# Altium schematic sheet MCU.SchDoc
size A4; SheetNumber: 3; SheetTotal: 5
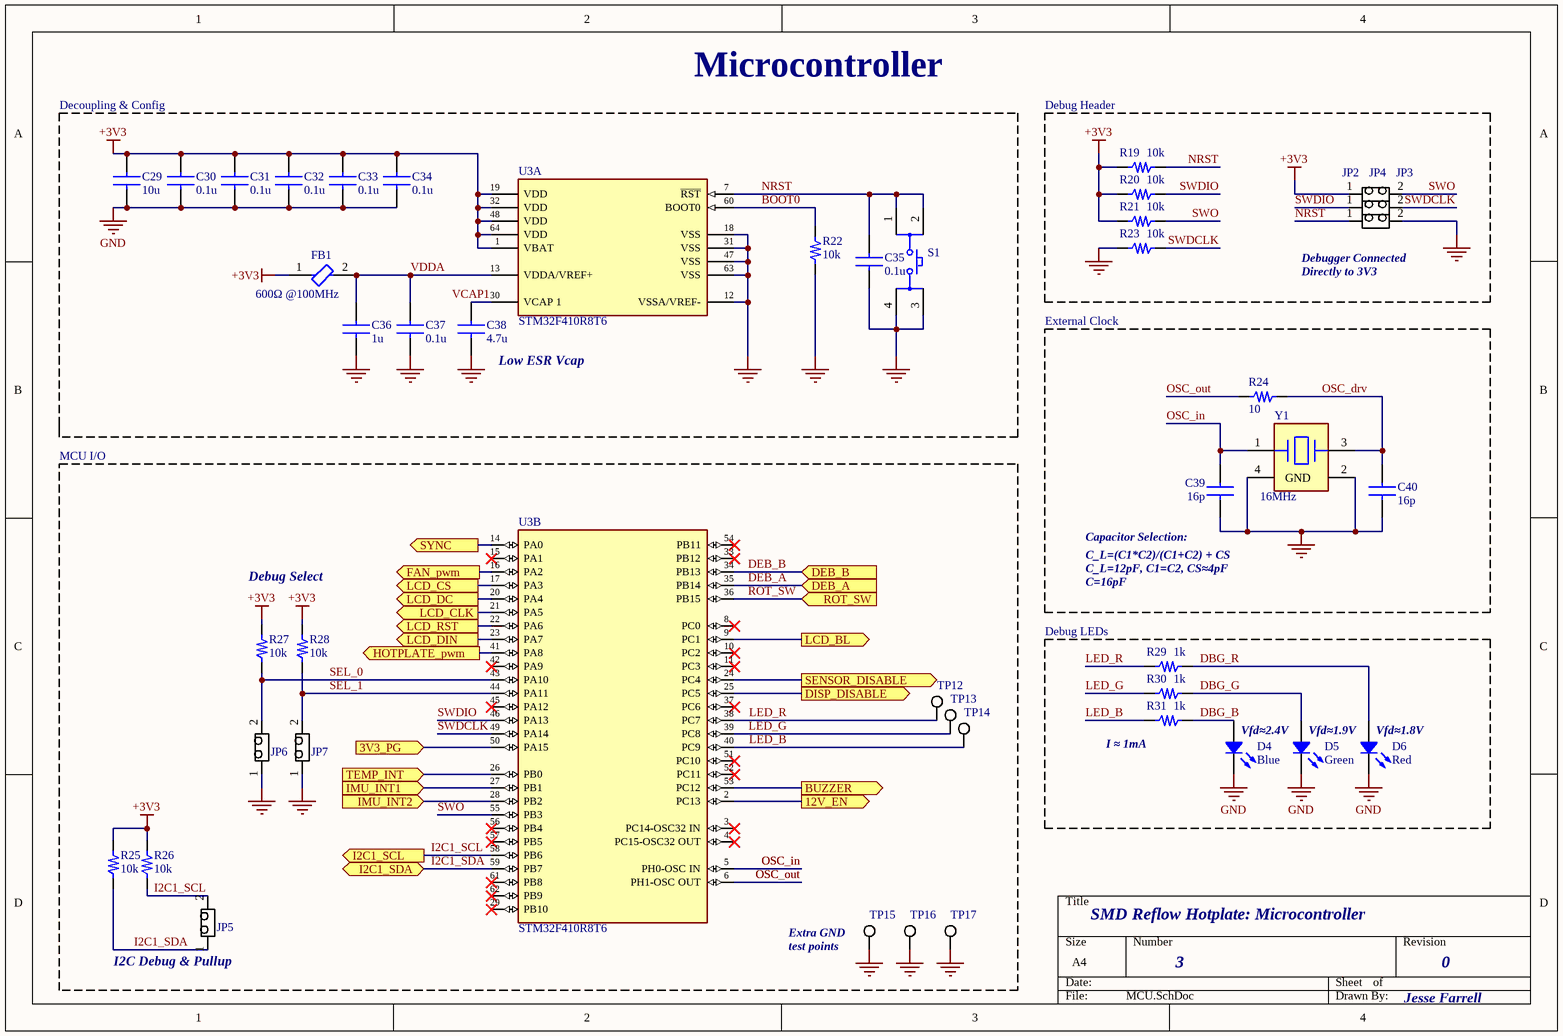
[diagram p0: MCU.SchDoc]

## Parts
C29  10u  [FP-CL10-IPC_C]
C30  0.1u  [FP-CL10-IPC_C]
C31  0.1u  [FP-CL10-IPC_C]
C32  0.1u  [FP-CL10-IPC_C]
C33  0.1u  [FP-CL10-IPC_C]
C34  0.1u  [FP-CL10-IPC_C]
C35  0.1u  [FP-CL10-IPC_C]
C36  1u  [FP-CL10-IPC_C]
C37  0.1u  [FP-CL10-IPC_C]
C38  4.7u  [FP-CL10-IPC_C]
C39  16p  [FP-CL10-IPC_C]
C40  16p  [FP-CL10-IPC_C]
D4  Blue  [LED 0603_1608 BLUE]
D5  Green  [LED 0603_1608 GREEN]
D6  Red  [LED 0603_1608 RED]
FB1  600Ω @100MHz  [FP-BLM18-0_15-t0_8-MFG]
JP2  HDR_1x2  [FP-TSW-102-07-L-S-MFG]  (value not drawn)
JP3  HDR_1x2  [FP-TSW-102-07-L-S-MFG]  (value not drawn)
JP4  HDR_1x2  [FP-TSW-102-07-L-S-MFG]  (value not drawn)
JP5  HDR_1x2  [FP-TSW-102-07-L-S-MFG]  (value not drawn)
JP6  HDR_1x2  [FP-TSW-102-07-L-S-MFG]  (value not drawn)
JP7  HDR_1x2  [FP-TSW-102-07-L-S-MFG]  (value not drawn)
R19  10k  [FP-RMCF0603-MFG]
R20  10k  [FP-RMCF0603-MFG]
R21  10k  [FP-RMCF0603-MFG]
R22  10k  [FP-RMCF0603-MFG]
R23  10k  [FP-RMCF0603-MFG]
R24  10  [FP-RMCF0603-MFG]
R25  10k  [FP-RMCF0603-MFG]
R26  10k  [FP-RMCF0603-MFG]
R27  10k  [FP-RMCF0603-MFG]
R28  10k  [FP-RMCF0603-MFG]
R29  1k  [FP-RMCF0603-MFG]
R30  1k  [FP-RMCF0603-MFG]
R31  1k  [FP-RMCF0603-MFG]
S1  PushButton  [FP-TL3301AF160QG-MFG]  (value not drawn)
TP12  TEST POINT  [KSTN-5003]  (value not drawn)
TP13  TEST POINT  [KSTN-5003]  (value not drawn)
TP14  TEST POINT  [KSTN-5003]  (value not drawn)
TP15  BLCK TEST POINT  [FP-5001-MFG]  (value not drawn)
TP16  BLCK TEST POINT  [FP-5001-MFG]  (value not drawn)
TP17  BLCK TEST POINT  [FP-5001-MFG]  (value not drawn)
U3  STM32F410R8T6  [FP-LQFP64-5W-IPC_B]  (parts A,B of 2)
Y1  16MHz  [FP-8Y-MFG]

## Blocks framed on the sheet
Debug Header: JP2-JP4 R19-R21 R23
Debug LEDs: D4-D6 R29-R31

## Ports
3V3_PG (in), 12V_EN (out), BUZZER (out), DEB_A (in), DEB_B (in), DISP_DISABLE (out), FAN_pwm (out), HOTPLATE_pwm (out), I2C1_SCL (out), I2C1_SDA (bidir), IMU_INT1 (in), IMU_INT2 (in), LCD_BL (out), LCD_CLK (out), LCD_CS (out), LCD_DC (out), LCD_DIN (out), LCD_RST (out), ROT_SW (in), SENSOR_DISABLE (out), SYNC (out), TEMP_INT (in)

## Nets
+3V3: C29.1 C30.1 C31.1 C32.1 C33.1 C34.1 FB1.1 JP2.1 R19.2 R20.2 R21.2 R25.2 R26.2 R27.2 R28.2 U3.1(VBAT) U3.19(VDD) U3.32(VDD) U3.48(VDD) U3.64(VDD)
GND: C29.2 C30.2 C31.2 C32.2 C33.2 C34.2 C35.2 C36.2 C37.2 C38.2 C39.2 C40.2 D4.2 D5.2 D6.2 JP4.2 JP6.1 JP7.1 R22.1 R23.2 S1.3 S1.4 TP15.1 TP16.1 TP17.1 U3.12(VSSA/VREF-) U3.18(VSS) U3.31(VSS) U3.47(VSS) U3.63(VSS) Y1.2(GND) Y1.4(GND)
3V3_PG: U3.50(PA15) ; port 3V3_PG
12V_EN: U3.2(PC13) ; port 12V_EN
BOOT0: R22.2 U3.60(BOOT0)
BUZZER: U3.53(PC12) ; port BUZZER
DBG_B: D4.1 R31.1
DBG_G: D5.1 R30.1
DBG_R: D6.1 R29.1
DEB_A: U3.35(PB14) ; port DEB_A
DEB_B: U3.34(PB13) ; port DEB_B
DISP_DISABLE: U3.25(PC5) ; port DISP_DISABLE
FAN_pwm: U3.16(PA2) ; port FAN_pwm
HOTPLATE_pwm: U3.41(PA8) ; port HOTPLATE_pwm
I2C1_SCL: JP5.2 R26.1 U3.58(PB6) ; port I2C1_SCL
I2C1_SDA: JP5.1 R25.1 U3.59(PB7) ; port I2C1_SDA
IMU_INT1: U3.27(PB1) ; port IMU_INT1
IMU_INT2: U3.28(PB2) ; port IMU_INT2
LCD_BL: U3.9(PC1) ; port LCD_BL
LCD_CLK: U3.21(PA5) ; port LCD_CLK
LCD_CS: U3.17(PA3) ; port LCD_CS
LCD_DC: U3.20(PA4) ; port LCD_DC
LCD_DIN: U3.23(PA7) ; port LCD_DIN
LCD_RST: U3.22(PA6) ; port LCD_RST
LED_B: R31.2 TP14.1 U3.40(PC9)
LED_G: R30.2 TP13.1 U3.39(PC8)
LED_R: R29.2 TP12.1 U3.38(PC7)
NRST: C35.1 JP4.1 R19.1 S1.1 S1.2 U3.7(~{RST})
OSC_drv: C40.1 R24.1 Y1.3
OSC_in: C39.1 U3.5(PH0-OSC_IN) Y1.1
OSC_out: R24.2 U3.6(PH1-OSC_OUT)
ROT_SW: U3.36(PB15) ; port ROT_SW
SEL_0: JP6.2 R27.1 U3.43(PA10)
SEL_1: JP7.2 R28.1 U3.44(PA11)
SENSOR_DISABLE: U3.24(PC4) ; port SENSOR_DISABLE
SWDCLK: JP3.2 R23.1 U3.49(PA14)
SWDIO: JP3.1 R20.1 U3.46(PA13)
SWO: JP2.2 R21.1 U3.55(PB3)
SYNC: U3.14(PA0) ; port SYNC
TEMP_INT: U3.26(PB0) ; port TEMP_INT
VCAP1: C38.1 U3.30(VCAP_1)
VDDA: C36.1 C37.1 FB1.2 U3.13(VDDA/VREF+)

Not connected (* = marked no-connect by the designer): U3 3(PC14-OSC32_IN)* 4(PC15-OSC32_OUT)* 8(PC0)* 10(PC2)* 11(PC3)* 15(PA1)* 29(PB10)* 33(PB12)* 37(PC6)* 42(PA9)* 45(PA12)* 51(PC10)* 52(PC11)* 54(PB11)* 56(PB4)* 57(PB5)* 61(PB8)* 62(PB9)*

## Notes on the sheet
- Decoupling & Config
- Microcontroller
- Debugger Connected
  Directly to 3V3
- Low ESR Vcap
- External Clock
- MCU I/O
- Debug Select
- (near C39) Capacitor Selection: <https://www.st.com/resource/en/application_note/cd00221665-oscillator-design-guide-for-stm8afals-stm32-mcus-and-mpus-stmicroelectronics.pdf>
- C_L=(C1*C2)/(C1+C2) + CS
  C_L=12pF, C1=C2, CS≈4pF
  C=16pF
- (near R31) I ≈ 1mA
- (near D5) Vfd≈2.4V
- (near D6) Vfd≈1.9V
- (near D6) Vfd≈1.8V
- (near JP5) I2C Debug & Pullup
- (near TP15) Extra GND
  test points
- SMD Reflow Hotplate: Microcontroller
- 3
- 0
- Jesse Farrell

## Library data of the parts
C29 = CapTemplate0603: Cap Ceramic 10uF 16V X5R 10% SMD 0603; Capacitance: 0.1uF; Supplier 1: Digi-Key; RoHS: Yes; Category: Ceramic Capacitors; Mount: Surface Mount; Case/Package: 0603; Case Code (Metric): 1608; Case Code (Imperial): 0603; Packaging: Tape and Reel; Voltage Rating: 16V; Tolerance: 10%; Length: 0.063inch; Width: 0.031inch; Thickness: 0.035inch; ComponentLink1Description: DigikeyPart; ComponentLink1URL: https://www.digikey.ca/en/products/detail/samsung-electro-mechanics/CL10B104KO8NNNC/3886663
C30-C35 C37 = CapTemplate0603: Cap Ceramic 0.1uF 16V X7R 10% SMD 0603; Supplier 1: Digi-Key; RoHS: Yes; Category: Ceramic Capacitors; Mount: Surface Mount; Case/Package: 0603; Case Code (Metric): 1608; Case Code (Imperial): 0603; Packaging: Tape and Reel; Capacitance: 0.1uF; Voltage Rating: 16V; Tolerance: 10%; Length: 0.063inch; Width: 0.031inch; Thickness: 0.035inch; ComponentLink1Description: DigikeyPart; ComponentLink1URL: https://www.digikey.ca/en/products/detail/samsung-electro-mechanics/CL10B104KO8NNNC/3886663
C36 = CapTemplate0603: Cap Ceramic 1uF 16V X5R 10% SMD 0603; Supplier 1: Digi-Key; RoHS: Yes; Category: Ceramic Capacitors; Mount: Surface Mount; Case/Package: 0603; Case Code (Metric): 1608; Case Code (Imperial): 0603; Packaging: Tape and Reel; Capacitance: 1uF; Voltage Rating: 16V; Tolerance: 10%; Length: 0.063inch; Width: 0.031inch; Thickness: 0.035inch; ComponentLink1Description: DigikeyPart; ComponentLink1URL: https://www.digikey.ca/en/products/detail/samsung-electro-mechanics/CL10B104KO8NNNC/3886663
C38 = CapTemplate0603: Cap Ceramic 4.7uF 16V X5R 10% SMD 0603; Supplier 1: Digi-Key; RoHS: Yes; Category: Ceramic Capacitors; Mount: Surface Mount; Case/Package: 0603; Case Code (Metric): 1608; Case Code (Imperial): 0603; Packaging: Tape and Reel; Capacitance: 4.7uF; Voltage Rating: 16V; Tolerance: 10%; Length: 0.063inch; Width: 0.031inch; Thickness: 0.035inch
C39 C40 = CapTemplate0603: Cap Ceramic 16p 10V X7R 10% SMD 0603; Capacitance: ??uF; Voltage Rating: ??V; Tolerance: ??%; Supplier 1: Digi-Key; RoHS: Yes; Category: Ceramic Capacitors; Mount: Surface Mount; Case/Package: 0603; Case Code (Metric): 1608; Case Code (Imperial): 0603; Packaging: Tape and Reel; Length: 0.063inch; Width: 0.031inch; Thickness: 0.035inch
D4 = AA1608QBS/D-10MAV: 1.6X0.8MM BLUE SMD LED; Manufacturer: Kingbright; Current - Test: 10mA; Lens Color: Colorless; Lens Size: 1.40mm x 0.80mm; Lens Style: Rectangle with Flat Top; Lens Transparency: Clear; Millicandela Rating: 80mcd; Viewing Angle: 120°; Voltage - Forward (Vf) (Typ): 3V; Wavelength - Dominant: 465nm; Wavelength - Peak: 460nm; Part Number: AA1608QBS/D-10MAV; Color: Blue; ComponentLink1Description: Datasheet; ComponentLink1URL: https://www.kingbrightusa.com/images/catalog/SPEC/AA1608QBS-D-10MAV.pdf; ComponentLink2Description: DigiKey Link; ComponentLink2URL: https://www.digikey.com/en/products/detail/kingbright/AA1608QBS-D-10MAV/13997416; Device Package: 0603 (1608 Metric); Height (Max): 0.65mm; LastUpdated: 2022-06-14 9:41:25 PM; Lifecycle Status: Active; Minimum Order: 1; Mounting Type: Surface Mount; Package / Case: 0603 (1608 Metric); Packaging: TapeAndReel; PartId: 972; Part Status: Active; Price: 0.12; Series: -; Size / Dimension: 1.60mm L x 0.80mm W; Supplier 1: DigiKey; Supplier Part Number 1: 754-AA1608QBS/D-10MAVCT-ND; Supplier Device Package: 0603; Value: Blue
D5 = AA1608CGSK: 1.6X0.8MM GREEN SMD LED; Manufacturer: Kingbright; Current - Test: 20mA; Lens Color: Colorless; Lens Style: Rectangle with Flat Top; Lens Transparency: Clear; Millicandela Rating: 75mcd; Viewing Angle: 120°; Voltage - Forward (Vf) (Typ): 2.1V; Wavelength - Dominant: 570nm; Wavelength - Peak: 574nm; Part Number: AA1608CGSK; Color: Green; ComponentLink1Description: Datasheet; ComponentLink1URL: https://www.kingbrightusa.com/images/catalog/SPEC/AA1608CGSK.pdf; ComponentLink2Description: DigiKey Link; ComponentLink2URL: https://www.digikey.com/en/products/detail/kingbright/AA1608CGSK/13679426; Device Package: 0603 (1608 Metric); Height (Max): 0.70mm; LastUpdated: 2022-06-12 5:46:55 PM; Lifecycle Status: Active; Minimum Order: 1; Mounting Type: Surface Mount; Package / Case: 0603 (1608 Metric); Packaging: TapeAndReel; PartId: 995; Part Status: Active; Price: 0.12; Series: -; Size / Dimension: 1.60mm L x 0.80mm W; Supplier 1: DigiKey; Supplier Part Number 1: 754-AA1608CGSKCT-ND; Supplier Device Package: 0603; Value: Green
D6 = AA1608SURSK: 1.6X0.8MM RED SMD LED; Manufacturer: Kingbright; Current - Test: 20mA; Lens Color: Colorless; Lens Style: Rectangle with Flat Top; Lens Transparency: Clear; Millicandela Rating: 480mcd; Viewing Angle: 120°; Voltage - Forward (Vf) (Typ): 1.95V; Wavelength - Dominant: 630nm; Wavelength - Peak: 645nm; Part Number: AA1608SURSK; Color: Red; ComponentLink1Description: Datasheet; ComponentLink1URL: https://www.kingbrightusa.com/images/catalog/SPEC/AA1608SURSK.pdf; ComponentLink2Description: DigiKey Link; ComponentLink2URL: https://www.digikey.com/en/products/detail/kingbright/AA1608SURSK/13679445; Device Package: 0603 (1608 Metric); Height (Max): 0.70mm; LastUpdated: 2022-06-14 9:41:53 PM; Lifecycle Status: Active; Minimum Order: 1; Mounting Type: Surface Mount; Package / Case: 0603 (1608 Metric); Packaging: TapeAndReel; PartId: 1013; Part Status: Active; Price: 0.12; Series: -; Size / Dimension: 1.60mm L x 0.80mm W; Supplier 1: DigiKey; Supplier Part Number 1: 754-AA1608SURSKCT-ND; Supplier Device Package: 0603; Value: Red
FB1 = 782633601: Ferrite Bead, Aec-Q200, 600 Ohm, 0603 Rohs Compliant: Yes; Manufacturer: Wurth Electronics; Number of Lines: 1; Max Current Rating: 1A; DC Resistance (DCR): 200mR; Supplier 1: Digi-Key; Manufacturer Part Number: 782633601; RoHS: Yes; Category: Ferrite Beads and Chips; Stock 1: 21300; Mount: Surface Mount; Case/Package: 0603; Case Code (Metric): 1608; Case Code (Imperial): 0603; Min Operating Temperature: -55°C; Max Operating Temperature: 125°C; Package Quantity: 4000; Packaging: Tape and Reel; Length: 0.063inch; Width: 0.031inch; Height: 0.039inch; Ratings: AEC-Q200; RoHS Compliant: No; ComponentLink1URL: https://media.digikey.com/pdf/Data%20Sheets/Wurth%20Electronics%20PDFs/Q+_Products_Flyer.pdf?src-supplier=Digi-Key; ComponentLink1Description: https://media.digikey.com/pdf/Data%20Sheets/Wurth%20Electronics%20PDFs/Q+_Products_Flyer.pdf?src-supplier=Digi-Key; ComponentLink2URL: http://katalog.we-online.de/pbs/datasheet/782633601.pdf?src-supplier=Digi-Key; ComponentLink2Description: http://katalog.we-online.de/pbs/datasheet/782633601.pdf?src-supplier=Digi-Key; Supplier Part Number 1: 732-6703-1-ND
JP2-JP7 = PH1-02-UA: Conn Unshrouded Header HDR 2 POS 2.54mm Solder ST Thru-Hole Bag; Manufacturer: Adam Equipment; Current Rating: 3A; Voltage Rating: 250V; Number of Positions: 2; Supplier 1: Digi-Key; Manufacturer Part Number: PH1-02-UA; RoHS: Yes; Category: Connectors; Stock 1: 124311; Contact Material: Brass; Contact Plating: Gold; Housing Material: PBT; Contact Gender: Male; Number of Rows: 1; Termination: Solder; Pitch: 2.54mm; Lead Free: Lead Free; ComponentLink1URL: https://datasheet.ciiva.com/16392/ph1-xx-ua-16392701.pdf?src-supplier=Future+Electronics; ComponentLink1Description: https://datasheet.ciiva.com/16392/ph1-xx-ua-16392701.pdf?src-supplier=Future+Electronics; ComponentLink2URL: https://datasheet.ciiva.com/5160/page-292-295-12946-5160830.pdf?src-supplier=Mouser; ComponentLink2Description: https://datasheet.ciiva.com/5160/page-292-295-12946-5160830.pdf?src-supplier=Mouser; Supplier Part Number 1: 2057-PH1-02-UA-ND
R19-R23 R25-R28 = ResTemplate0603: Res 0603 10K Ohm 1% 1/10W; Tolerance: ???%; Power Rating: ???mW; Resistance: ???; Supplier 1: Digi-Key; Category: Chip SMD Resistors; Mount: Surface Mount; Case/Package: 0603; Case Code (Metric): 1608; Case Code (Imperial): 0603; Number of Terminations: 2; Length: 0.061inch; Width: 0.031inch; Height: 0.022inch
R24 = ResTemplate0603: Res 0603 10 Ohm 1% 1/10W; Tolerance: ???%; Power Rating: ???mW; Resistance: ???; Supplier 1: Digi-Key; Category: Chip SMD Resistors; Mount: Surface Mount; Case/Package: 0603; Case Code (Metric): 1608; Case Code (Imperial): 0603; Number of Terminations: 2; Length: 0.061inch; Width: 0.031inch; Height: 0.022inch
R29-R31 = ResTemplate0603: Res 0603 1K Ohm 1% 1/8W; Tolerance: ???%; Power Rating: ???mW; Resistance: ???; Supplier 1: Digi-Key; Category: Chip SMD Resistors; Mount: Surface Mount; Case/Package: 0603; Case Code (Metric): 1608; Case Code (Imperial): 0603; Number of Terminations: 2; Length: 0.061inch; Width: 0.031inch; Height: 0.022inch
S1 = PTS645SL43SMTR92LFS: Switch Tactile N.O. SPST Round Button Gull Wing 0.05A 12VDC 100000Cycles 1.27N SMD T/R; Manufacturer: ITT C&K; Actuator Material: Nylon,Polyamide,PA66; Max Voltage Rating (DC): 12V; Contact Resistance: 100mR; Max Current Rating: 50mA; Illumination Type: Non-Illuminated; Switch Function: Off-Mom; Actuator Type: Standard; Actuator Length: 0.85mm; Supplier 1: Digi-Key; Manufacturer Part Number: PTS645SL43SMTR92LFS; RoHS: Yes; Category: Tactile Switches; Stock 1: 20686; Mount: Surface Mount; Contact Material: Bronze,Brass,Silver; Contact Plating: Silver; Mechanical Life: 100000Cycles; Color: Black; Min Operating Temperature: -20°C; Max Operating Temperature: 60°C; Throw Configuration: SPST; Operating Force: 1.27N; Packaging: Tape and Reel; Termination: Gull Wing; Voltage Rating (DC): 12V; Package Quantity: 1000; Current Rating: 50mA; Orientation: Straight; Series: PTS645; Length: 6mm; Depth: 9mm; Size: 6mm; Lead Free: Lead Free; RoHS Compliant: Yes; ComponentLink1URL: https://datasheet.ciiva.com/26927/getdatasheetpartid-774114-26927132.pdf?src-supplier=Verical; ComponentLink1Description: https://datasheet.ciiva.com/26927/getdatasheetpartid-774114-26927132.pdf?src-supplier=Verical; Supplier Part Number 1: CKN10880CT-ND
TP12-TP14 = 5003: Test Point;  Miniature;  THM;  H .300;  Nylon 46 Insulated Orange;  PhosBronze/Silver; Manufacturer: Keystone Electronics; Body Material: PBT; Plating: Silver; Inside Diameter: 1.27mm; Outside Diameter: 2.54mm; Supplier 1: Digi-Key; Manufacturer Part Number: 5003; RoHS: Yes; Category: Connectors; Stock 1: 166018; Mount: PCB,Through Hole; Number of Pins: 1; Contact Material: Bronze; Contact Plating: Silver,Tin; Material: Nylon,Bronze,Silver; Color: Orange,White; Package Quantity: 10; Packaging: Bulk; Series: THM; Termination: Through Hole; Length: 7.62mm; Height: 0.3inch; REACH SVHC: No SVHC; Lead Free: Lead Free; RoHS Compliant: Yes; Flammability Rating: UL94 V-0; ComponentLink1URL: https://datasheet.ciiva.com/16885/70182825-16885788.pdf?src-supplier=Allied+Electronics; ComponentLink1Description: https://datasheet.ciiva.com/16885/70182825-16885788.pdf?src-supplier=Allied+Electronics; ComponentLink2URL: https://datasheet.ciiva.com/1454/1703983-1454826.pdf?src-supplier=Element14; ComponentLink2Description: https://datasheet.ciiva.com/1454/1703983-1454826.pdf?src-supplier=Element14; ComponentLink3URL: https://datasheet.ciiva.com/22631/1703983-22631103.pdf?src-supplier=Element14; ComponentLink3Description: https://datasheet.ciiva.com/22631/1703983-22631103.pdf?src-supplier=Element14; ComponentLink4URL: https://datasheet.ciiva.com/4598/5000-5004-4598618.pdf?src-supplier=Mouser; ComponentLink4Description: https://datasheet.ciiva.com/4598/5000-5004-4598618.pdf?src-supplier=Mouser; Supplier Part Number 1: 36-5003-ND
TP15-TP17 = 5001: TEST POINT PC MINI .040D BLACK; Manufacturer: Keystone Electronics; Body Material: Bronze; Plating: Silver; Number of Ports: 1; Insulation: Insulated; Inside Diameter: 1.27mm; Outside Diameter: 2.54mm; Hole Diameter: 1.6mm; Supplier 1: Digi-Key; Manufacturer Part Number: 5001; RoHS: Yes; Category: Test Probes, Leads and Clips; Stock 1: 1368499; Mount: Through Hole; Contact Material: Bronze; Contact Plating: Silver,Tin; Material: Nylon,Bronze,Silver; Color: Black; Insulation Material: Nylon; Housing Color: Black; Package Quantity: 100; Packaging: Bulk; Series: THM; Termination: Through Hole; Orientation: Straight; Number of Contacts: 1; Diameter: 2.54mm; Length: 7.62mm; Height: 0.3inch; REACH SVHC: No SVHC; Lead Free: Lead Free; RoHS Compliant: Yes; Flammability Rating: UL94 V-0; ComponentLink1URL: https://datasheet.ciiva.com/11836/0900766b8009b7c7-11836045.pdf?src-supplier=RSComponents; ComponentLink1Description: https://datasheet.ciiva.com/11836/0900766b8009b7c7-11836045.pdf?src-supplier=RSComponents; ComponentLink2URL: https://datasheet.ciiva.com/27052/1581986-27052611.pdf?src-supplier=Jameco; ComponentLink2Description: https://datasheet.ciiva.com/27052/1581986-27052611.pdf?src-supplier=Jameco; ComponentLink3URL: https://datasheet.ciiva.com/16318/m60-2p60-16318423.pdf?src-supplier=Future+Electronics; ComponentLink3Description: https://datasheet.ciiva.com/16318/m60-2p60-16318423.pdf?src-supplier=Future+Electronics; ComponentLink4URL: https://datasheet.ciiva.com/22631/1703983-22631100.pdf?src-supplier=Element14; ComponentLink4Description: https://datasheet.ciiva.com/22631/1703983-22631100.pdf?src-supplier=Element14; Supplier Part Number 1: 36-5001-ND
U3 = STM32F410R8T6: MCU 32-bit ARM Cortex M4 RISC 64KB Flash 3.3V 64-Pin LQFP Frame; Manufacturer: STMicroelectronics; Interface: I2C,SPI,IrDA,UART,USART; Peripherals: Brown-out Detect/Reset,POR,PWM,WDT,DMA; Frequency: 100MHz; Number of I/Os: 50; Oscillator Type: Internal; Supplier 1: Digi-Key; Manufacturer Part Number: STM32F410R8T6; RoHS: Yes; Category: Microcontrollers; Case/Package: LQFP; Min Operating Temperature: -40°C; Max Operating Temperature: 85°C; Memory Type: FLASH; Packaging: Tray; Core Architecture: ARM; Memory Size: 64KB; RoHS Compliant: Yes; ComponentLink1URL: http://www.mouser.com/ds/2/389/stm32f410cb-956320.pdf?src-supplier=Mouser; ComponentLink1Description: http://www.mouser.com/ds/2/389/stm32f410cb-956320.pdf?src-supplier=Mouser; ComponentLink2URL: http://www.st.com/content/ccc/resource/technical/document/datasheet/6e/f3/b0/1b/05/eb/49/fe/DM00214043.pdf/files/DM00214043.pdf/jcr:content/translations/en.DM00214043.pdf?src-supplier=Digi-Key; ComponentLink2Description: http://www.st.com/content/ccc/resource/technical/document/datasheet/6e/f3/b0/1b/05/eb/49/fe/DM00214043.pdf/files/DM00214043.pdf/jcr:content/translations/en.DM00214043.pdf?src-supplier=Digi-Key; Supplier Part Number 1: 497-18544-ND
Y1 = Crystal_Template: Crystal Template for 4-SMD Crystal